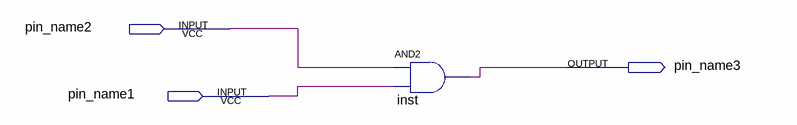
[diagram p0: schematic sheet]
// Quartus schematic teste.bdf as structural Verilog: 1 symbols, 3 pins
module teste (
  input  pin_name2,
  input  pin_name1,
  output pin_name3
);

  and inst (pin_name3, pin_name2, pin_name1);
endmodule
